# Altium project scale_AD7190_Project.PrjPCB
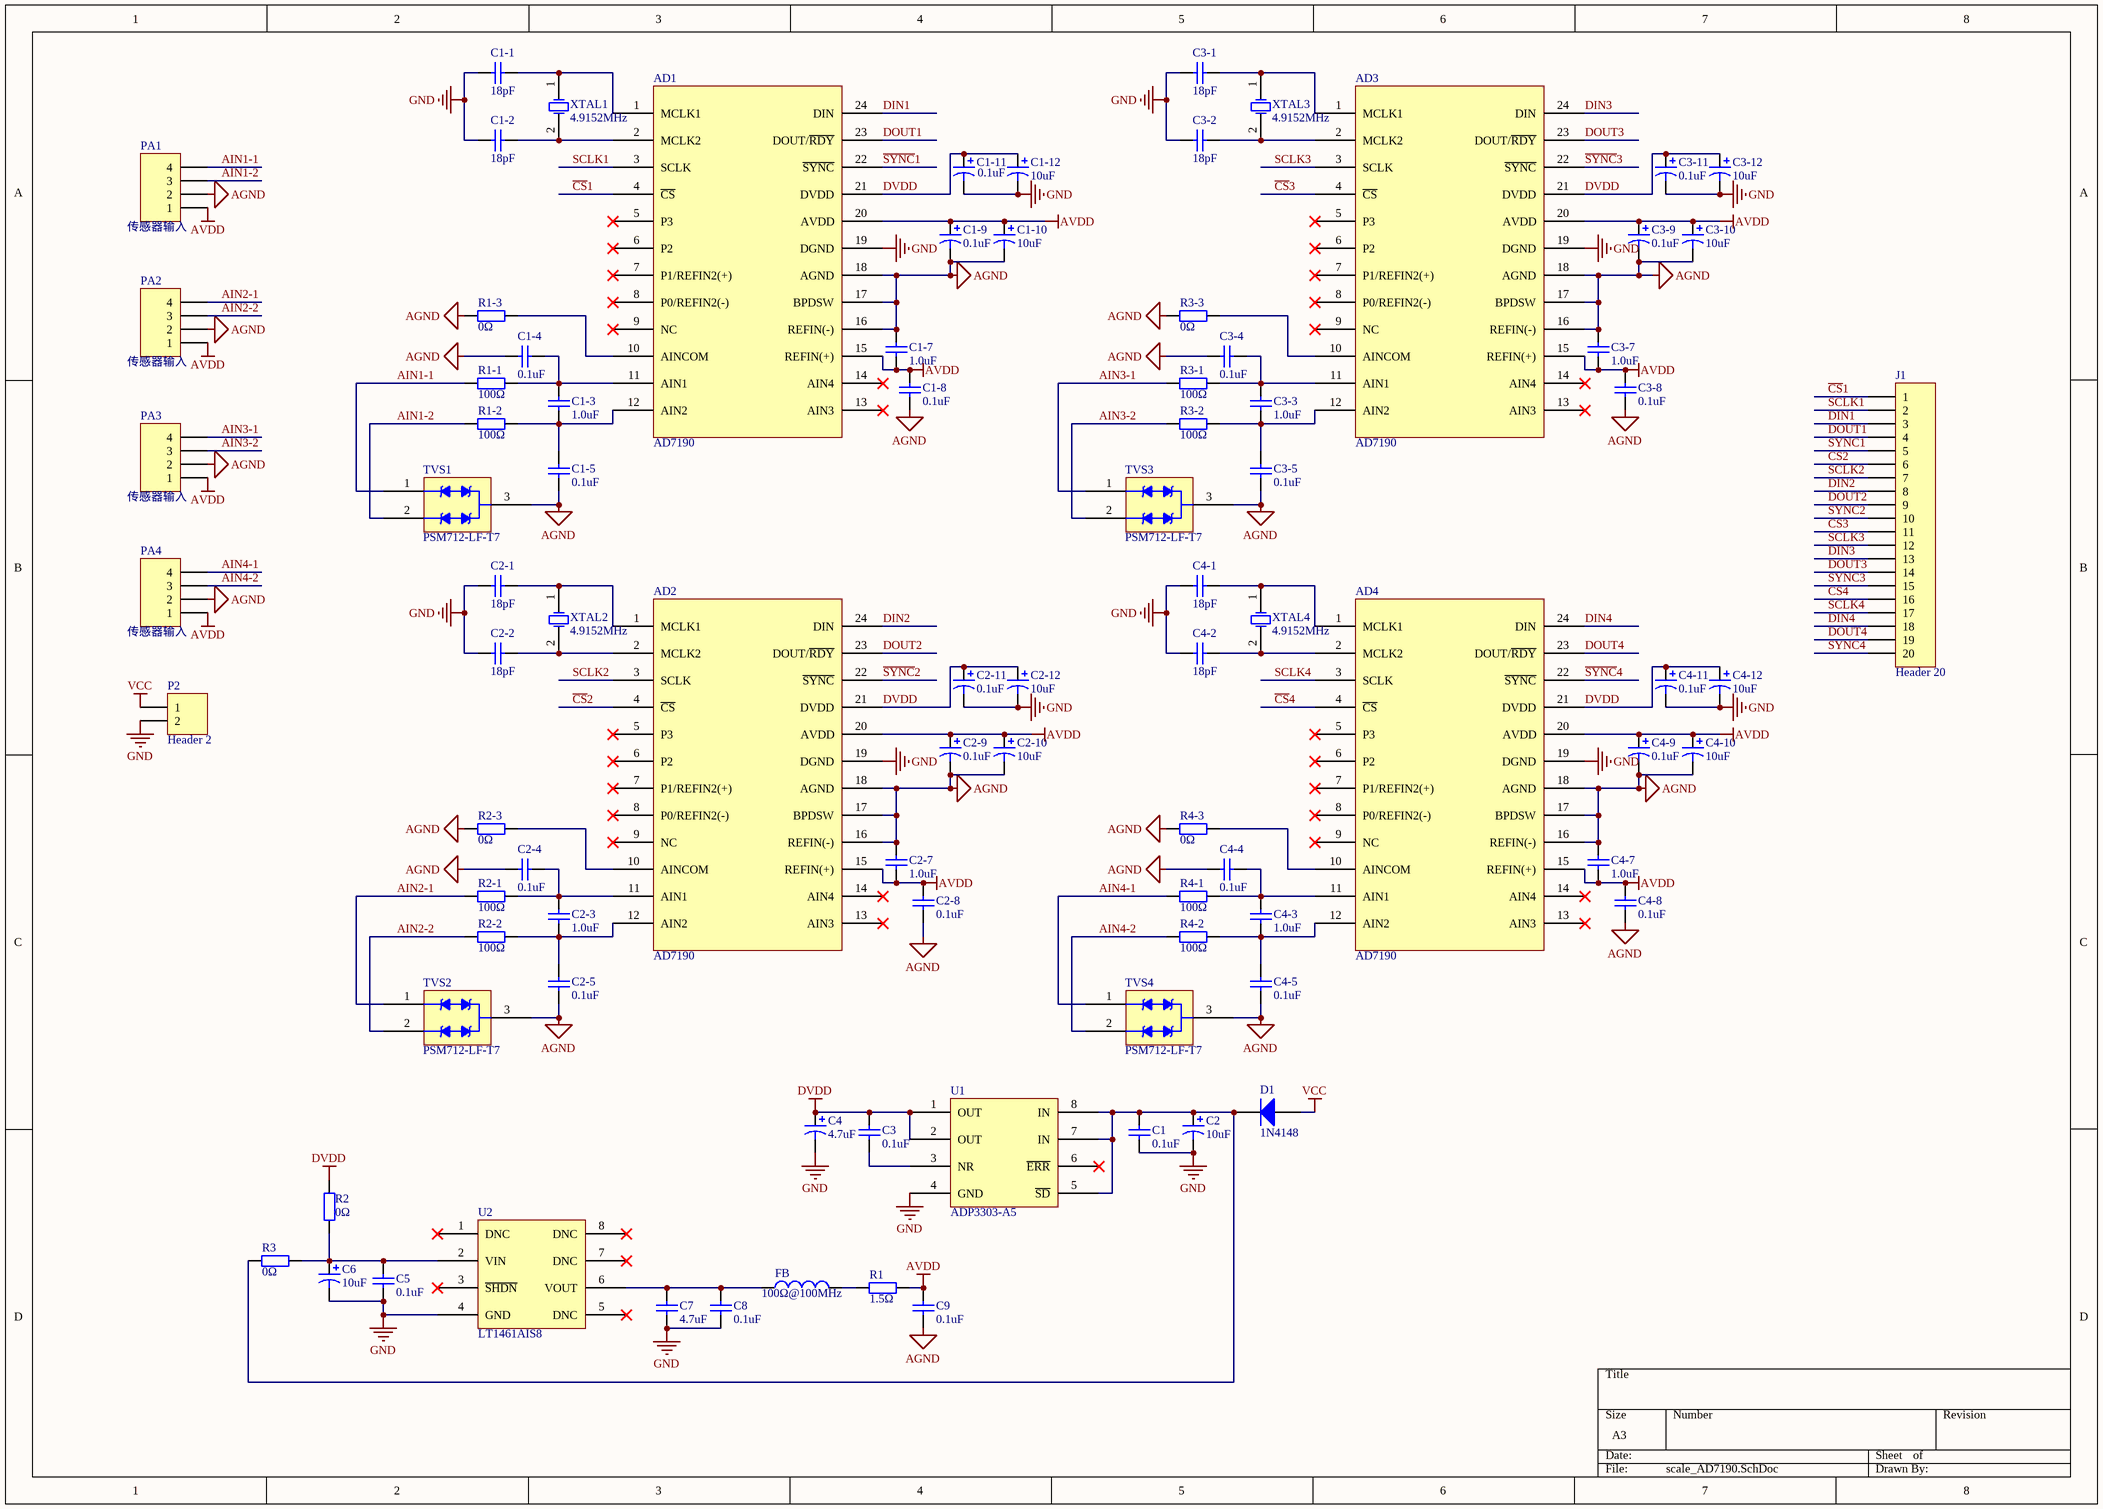
[diagram p0: scale_AD7190.SchDoc]
1 sheet, 90 parts. Net scope: global (net labels, ports and power ports of the same name join across sheets).
Board file: scale_AD7190.PcbDoc

## Sheet scale_AD7190.SchDoc
size A3

### Parts
AD1  AD7190  [TSOP-24N_AD7190]
AD2  AD7190  [TSOP-24N_AD7190]
AD3  AD7190  [TSOP-24N_AD7190]
AD4  AD7190  [TSOP-24N_AD7190]
C1  0.1uF  [0805_C]
C1-1  18pF  [0805_C]
C1-2  18pF  [0805_C]
C1-3  1.0uF  [0805_C]
C1-4  0.1uF  [0805_C]
C1-5  0.1uF  [0805_C]
C1-7  1.0uF  [0805_C]
C1-8  0.1uF  [0805_C]
C1-9  0.1uF  [0805_C]
C1-10  10uF  [0805_C]
C1-11  0.1uF  [0805_C]
C1-12  10uF  [0805_C]
C2  10uF  [0805_C]
C2-1  18pF  [0805_C]
C2-2  18pF  [0805_C]
C2-3  1.0uF  [0805_C]
C2-4  0.1uF  [0805_C]
C2-5  0.1uF  [0805_C]
C2-7  1.0uF  [0805_C]
C2-8  0.1uF  [0805_C]
C2-9  0.1uF  [0805_C]
C2-10  10uF  [0805_C]
C2-11  0.1uF  [0805_C]
C2-12  10uF  [0805_C]
C3  0.1uF  [0805_C]
C3-1  18pF  [0805_C]
C3-2  18pF  [0805_C]
C3-3  1.0uF  [0805_C]
C3-4  0.1uF  [0805_C]
C3-5  0.1uF  [0805_C]
C3-7  1.0uF  [0805_C]
C3-8  0.1uF  [0805_C]
C3-9  0.1uF  [0805_C]
C3-10  10uF  [0805_C]
C3-11  0.1uF  [0805_C]
C3-12  10uF  [0805_C]
C4  4.7uF  [0805_C]
C4-1  18pF  [0805_C]
C4-2  18pF  [0805_C]
C4-3  1.0uF  [0805_C]
C4-4  0.1uF  [0805_C]
C4-5  0.1uF  [0805_C]
C4-7  1.0uF  [0805_C]
C4-8  0.1uF  [0805_C]
C4-9  0.1uF  [0805_C]
C4-10  10uF  [0805_C]
C4-11  0.1uF  [0805_C]
C4-12  10uF  [0805_C]
C5  0.1uF  [0805_C]
C6  10uF  [0805_C]
C7  4.7uF  [0805_C]
C8  0.1uF  [0805_C]
C9  0.1uF  [0805_C]
D1  1N4148  [SOD-323]
FB  value 100Ω@100MHz  [0805_L]  (hidden comment: Inductor)
J1  Header 20  [HDR1X20]
P2  Header 2  [端子2×5.08]
PA1  传感器输入  [端子4*5.08]
PA2  传感器输入  [端子4*5.08]
PA3  传感器输入  [端子4*5.08]
PA4  传感器输入  [端子4*5.08]
R1  1.5Ω  [0805_R]
R1-1  100Ω  [0805_R]
R1-2  100Ω  [0805_R]
R1-3  0Ω  [0805_R]
R2  0Ω  [0805_R]
R2-1  100Ω  [0805_R]
R2-2  100Ω  [0805_R]
R2-3  0Ω  [0805_R]
R3  0Ω  [0805_R]
R3-1  100Ω  [0805_R]
R3-2  100Ω  [0805_R]
R3-3  0Ω  [0805_R]
R4-1  100Ω  [0805_R]
R4-2  100Ω  [0805_R]
R4-3  0Ω  [0805_R]
TVS1  PSM712-LF-T7  [SOT-23(SOT-23-3)]
TVS2  PSM712-LF-T7  [SOT-23(SOT-23-3)]
TVS3  PSM712-LF-T7  [SOT-23(SOT-23-3)]
TVS4  PSM712-LF-T7  [SOT-23(SOT-23-3)]
U1  ADP3303-A5  [SOIC-8N-ADP3303-A5]
U2  LT1461AIS8  [SOIC-8N-LT1416]
XTAL1  4.9152MHz  [SMD-3225_4P]
XTAL2  4.9152MHz  [SMD-3225_4P]
XTAL3  4.9152MHz  [SMD-3225_4P]
XTAL4  4.9152MHz  [SMD-3225_4P]

### Nets
AGND: AD1.16(REFIN(-)) AD1.17(BPDSW) AD1.18(AGND) AD2.16(REFIN(-)) AD2.17(BPDSW) AD2.18(AGND) AD3.16(REFIN(-)) AD3.17(BPDSW) AD3.18(AGND) AD4.16(REFIN(-)) AD4.17(BPDSW) AD4.18(AGND) C1-4.2 C1-5.2 C1-7.1 C1-8.1 C1-9.2 C1-10.2 C2-4.2 C2-5.2 C2-7.1 C2-8.1 C2-9.2 C2-10.2 C3-4.2 C3-5.2 C3-7.1 C3-8.1 C3-9.2 C3-10.2 C4-4.2 C4-5.2 C4-7.1 C4-8.1 C4-9.2 C4-10.2 C9.2 PA1.2 PA2.2 PA3.2 PA4.2 R1-3.1 R2-3.1 R3-3.1 R4-3.1 TVS1.3 TVS2.3 TVS3.3 TVS4.3
AVDD: AD1.15(REFIN(+)) AD1.20(AVDD) AD2.15(REFIN(+)) AD2.20(AVDD) AD3.15(REFIN(+)) AD3.20(AVDD) AD4.15(REFIN(+)) AD4.20(AVDD) C1-7.2 C1-8.2 C1-9.1 C1-10.1 C2-7.2 C2-8.2 C2-9.1 C2-10.1 C3-7.2 C3-8.2 C3-9.1 C3-10.1 C4-7.2 C4-8.2 C4-9.1 C4-10.1 C9.1 PA1.1 PA2.1 PA3.1 PA4.1 R1.2
DVDD: AD1.21(DVDD) AD2.21(DVDD) AD3.21(DVDD) AD4.21(DVDD) C1-11.1 C1-12.1 C2-11.1 C2-12.1 C3.1 C3-11.1 C3-12.1 C4.1 C4-11.1 C4-12.1 R2.2 U1.1(OUT) U1.2(OUT)
GND: AD1.19(DGND) AD2.19(DGND) AD3.19(DGND) AD4.19(DGND) C1.2 C1-1.1 C1-2.1 C1-11.2 C1-12.2 C2.2 C2-1.1 C2-2.1 C2-11.2 C2-12.2 C3-1.1 C3-2.1 C3-11.2 C3-12.2 C4.2 C4-1.1 C4-2.1 C4-11.2 C4-12.2 C5.2 C6.2 C7.2 C8.2 P2.2 U1.4(GND) U2.4(GND)
VCC: D1.1(A) P2.1
AIN1-1: PA1.4 R1-1.1 TVS1.1
AIN1-2: PA1.3 R1-2.1 TVS1.2
AIN2-1: PA2.4 R2-1.1 TVS2.1
AIN2-2: PA2.3 R2-2.1 TVS2.2
AIN3-1: PA3.4 R3-1.1 TVS3.1
AIN3-2: PA3.3 R3-2.1 TVS3.2
AIN4-1: PA4.4 R4-1.1 TVS4.1
AIN4-2: PA4.3 R4-2.1 TVS4.2
~{CS}1: AD1.4(~{CS}) J1.1
~{CS}2: AD2.4(~{CS}) J1.6
~{CS}3: AD3.4(~{CS}) J1.11
~{CS}4: AD4.4(~{CS}) J1.16
DIN1: AD1.24(DIN) J1.3
DIN2: AD2.24(DIN) J1.8
DIN3: AD3.24(DIN) J1.13
DIN4: AD4.24(DIN) J1.18
DOUT1: AD1.23(DOUT/~{RDY}) J1.4
DOUT2: AD2.23(DOUT/~{RDY}) J1.9
DOUT3: AD3.23(DOUT/~{RDY}) J1.14
DOUT4: AD4.23(DOUT/~{RDY}) J1.19
~{SYNC}1: AD1.22(~{SYNC}) J1.5
~{SYNC}2: AD2.22(~{SYNC}) J1.10
~{SYNC}3: AD3.22(~{SYNC}) J1.15
~{SYNC}4: AD4.22(~{SYNC}) J1.20
SCLK1: AD1.3(SCLK) J1.2
SCLK2: AD2.3(SCLK) J1.7
SCLK3: AD3.3(SCLK) J1.12
SCLK4: AD4.3(SCLK) J1.17
NetAD1_1: AD1.1(MCLK1) C1-1.2 XTAL1.1(OSC1)
NetAD1_2: AD1.2(MCLK2) C1-2.2 XTAL1.2(OSC2)
NetAD1_10: AD1.10(AINCOM) R1-3.2
NetAD1_11: AD1.11(AIN1) C1-3.2 C1-4.1 R1-1.2
NetAD1_12: AD1.12(AIN2) C1-3.1 C1-5.1 R1-2.2
NetAD2_1: AD2.1(MCLK1) C2-1.2 XTAL2.1(OSC1)
NetAD2_2: AD2.2(MCLK2) C2-2.2 XTAL2.2(OSC2)
NetAD2_10: AD2.10(AINCOM) R2-3.2
NetAD2_11: AD2.11(AIN1) C2-3.2 C2-4.1 R2-1.2
NetAD2_12: AD2.12(AIN2) C2-3.1 C2-5.1 R2-2.2
NetAD3_1: AD3.1(MCLK1) C3-1.2 XTAL3.1(OSC1)
NetAD3_2: AD3.2(MCLK2) C3-2.2 XTAL3.2(OSC2)
NetAD3_10: AD3.10(AINCOM) R3-3.2
NetAD3_11: AD3.11(AIN1) C3-3.2 C3-4.1 R3-1.2
NetAD3_12: AD3.12(AIN2) C3-3.1 C3-5.1 R3-2.2
NetAD4_1: AD4.1(MCLK1) C4-1.2 XTAL4.1(OSC1)
NetAD4_2: AD4.2(MCLK2) C4-2.2 XTAL4.2(OSC2)
NetAD4_10: AD4.10(AINCOM) R4-3.2
NetAD4_11: AD4.11(AIN1) C4-3.2 C4-4.1 R4-1.2
NetAD4_12: AD4.12(AIN2) C4-3.1 C4-5.1 R4-2.2
NetC1_1: C1.1 C2.1 D1.2(K) R3.1 U1.5(~{SD}) U1.7(IN) U1.8(IN)
NetC3_2: C3.2 U1.3(NR)
NetC5_1: C5.1 C6.1 R2.1 R3.2 U2.2(VIN)
NetC7_1: C7.1 C8.1 FB.1 U2.6(VOUT)
NetFB_2: FB.2 R1.1

Not connected (* = marked no-connect by the designer): AD1 5(P3)* 6(P2)* 7(P1/REFIN2(+))* 8(P0/REFIN2(-))* 9(NC)* 13(AIN3)* 14(AIN4)*; AD2 5(P3)* 6(P2)* 7(P1/REFIN2(+))* 8(P0/REFIN2(-))* 9(NC)* 13(AIN3)* 14(AIN4)*; AD3 5(P3)* 6(P2)* 7(P1/REFIN2(+))* 8(P0/REFIN2(-))* 9(NC)* 13(AIN3)* 14(AIN4)*; AD4 5(P3)* 6(P2)* 7(P1/REFIN2(+))* 8(P0/REFIN2(-))* 9(NC)* 13(AIN3)* 14(AIN4)*; U1 6(~{ERR})*; U2 1(DNC)* 3(~{SHDN})* 5(DNC)* 7(DNC)* 8(DNC)*

### Library data of the parts
C1 C1-3-C1-5 C1-7 C1-8 C2-3-C2-5 C2-7 C2-8 C3 C3-3-C3-5 C3-7 C3-8 C4-3-C4-5 C4-7 C4-8 C5 C7-C9 = 0402 1.0uF (105) 10% 25V: 贴片电容; ComponentLink1Description: 供应商链接; ComponentLink1URL: http://www.szlcsc.com/product/details_53938.html; Package: 0402; Supplier: LC; SuppliersPartNumber: C52923
C1-1 C1-2 C2-1 C2-2 C3-1 C3-2 C4-1 C4-2 = 0402 15pF (150) 5% 50V: 贴片电容; ComponentLink1Description: 供应商链接; ComponentLink1URL: http://www.szlcsc.com/product/details_1900.html; Package: 0402; Supplier: LC; SuppliersPartNumber: C1548
C1-9-C1-12 C2 C2-9-C2-12 C3-9-C3-12 C4 C4-9-C4-12 C6 = Cap Pol3: Polarized Capacitor (Surface Mount); Published: 8-Jun-2000; LatestRevisionDate: 29-May-2009; LatestRevisionNote: IPC-7351 Footprint Added.; PackageReference: C0805; Publisher: Altium Limited; PackageDescription: Chip Capacitor
  C1-9 C1-11 C2-9 C2-11 C3-9 C3-11 C4-9 C4-11: Value: 0.1uF
  C1-10 C1-12 C2 C2-10 C2-12 C3-10 C3-12 C4-10 C4-12 C6: Value: 10uF
  C4: Value: 4.7uF
D1 = Diode 1N4148: High Conductance Fast Diode; Published: 8-Jun-2000; LatestRevisionDate: 17-Jul-2002; LatestRevisionNote: Re-released for DXP Platform.; DatasheetVersion: 1997; PackageReference: DO-35; Publisher: Altium Limited; PackageDescription: Diode, Axial; Body 3.8 x 1.9 mm (LxDia. max), Lead Dia. 0.53 mm (max); Code_JEDEC: DO-204-AH; ComponentLink1Description: Manufacturer Link; ComponentLink1URL: http://www.fairchildsemi.com/; ComponentLink2Description: Datasheet; ComponentLink2URL: http://www.fairchildsemi.com/ds/1N%2F1N4148.pdf
FB = Inductor: Code_IEC: 1005; Published: 8-Jun-2000; LatestRevisionDate: 29-May-2009; LatestRevisionNote: IPC-7351 Footprint Added.; PackageReference: 0402-A; Publisher: Altium Limited; PackageDescription: Chip Inductor; Code_JEITA: 0402
J1 = Header 20: Header, 20-Pin; LatestRevisionDate: 17-Jul-2002; LatestRevisionNote: Re-released for DXP Platform.; Publisher: Altium Limited
P2 = Header 2: Header, 2-Pin; LatestRevisionDate: 17-Jul-2002; LatestRevisionNote: Re-released for DXP Platform.; Publisher: Altium Limited
PA1-PA4 = Header 4: Header, 4-Pin; LatestRevisionDate: 17-Jul-2002; LatestRevisionNote: Re-released for DXP Platform.; Publisher: Altium Limited
R1 = 0402 1.2KΩ (1201) 1%: 贴片电阻; ComponentLink1Description: 供应商链接; ComponentLink1URL: http://www.szlcsc.com/product/details_26605.html; Package: 0402; Supplier: LC; SuppliersPartNumber: C25862
R1-1-R1-3 R2 R2-1-R2-3 R3 R3-1-R3-3 R4-1-R4-3 = 0402 100Ω (1000) 1%: 贴片电阻; ComponentLink1Description: 供应商链接; ComponentLink1URL: http://www.szlcsc.com/product/details_25819.html; Package: 0402; Supplier: LC; SuppliersPartNumber: C25076
TVS1-TVS4 = PSM712-LF-T7_[C32677]: TVS; ComponentLink1Description: 供应商链接; ComponentLink1URL: http://www.szlcsc.com/product/details_33642.html; Package: SOT-23(SOT-23-3); Supplier: LC; SuppliersPartNumber: C32677
U1 = ADP3303
XTAL1-XTAL4 = XTAL: Crystal Oscillator; Published: 8-Jun-2000; LatestRevisionDate: 17-Jul-2002; LatestRevisionNote: Re-released for DXP Platform.; PackageReference: R38; Publisher: Altium Limited; PackageDescription: Crystal, Thru-Hole; 2 Leads; Body 3.1 x 8.2 mm (Dia.xH)